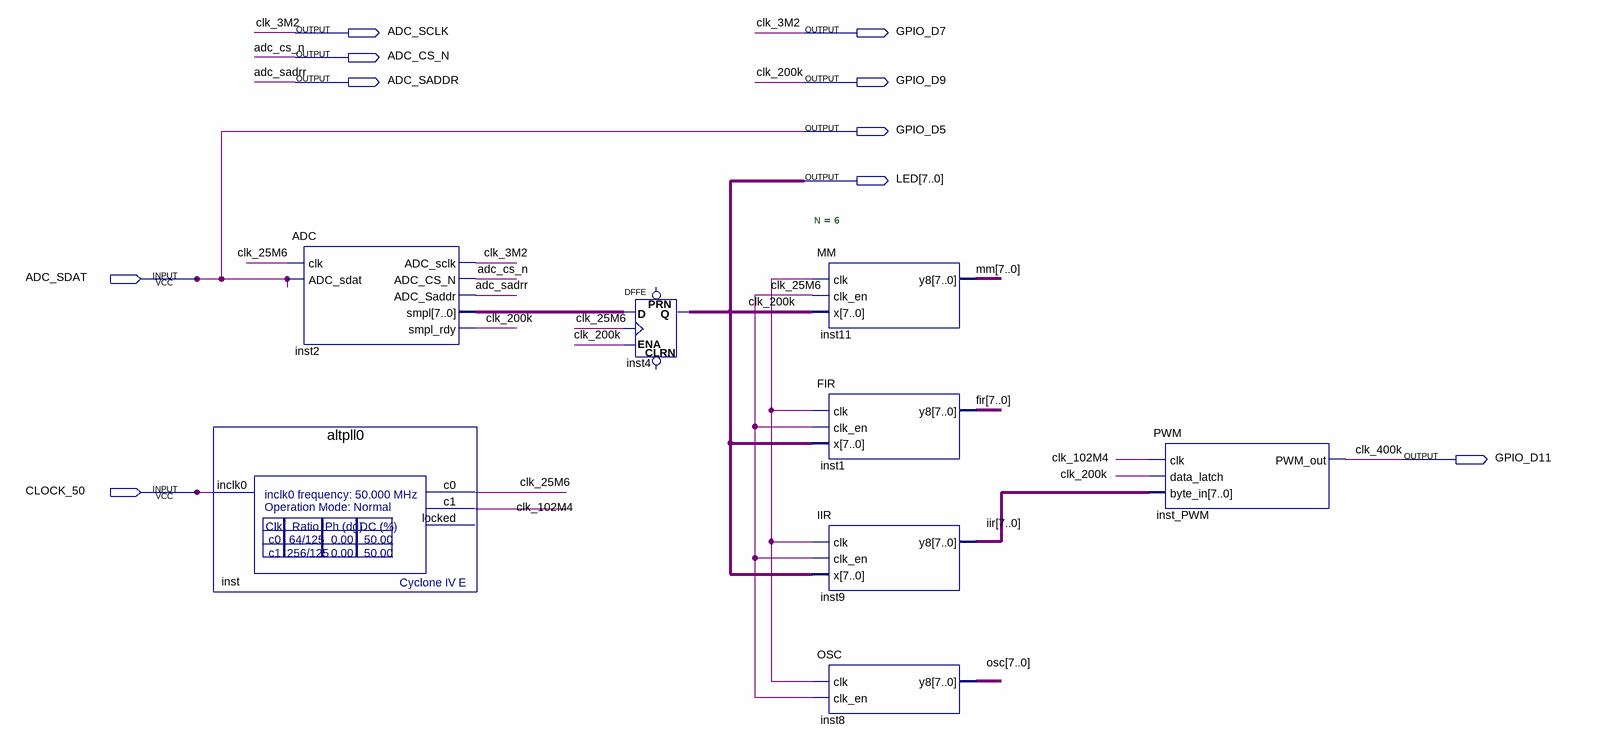
[diagram p0: schematic sheet]
// Quartus schematic main.bdf as structural Verilog: 8 symbols, 10 pins
module main (
  input  ADC_SDAT,
  input  CLOCK_50,
  output ADC_SCLK,
  output GPIO_D7,
  output ADC_CS_N,
  output ADC_SADDR,
  output GPIO_D9,
  output GPIO_D5,
  output [7:0] LED,
  output GPIO_D11
);

  wire clk_25M6, clk_102M4;
  wire [7:0] fir, iir, inst2_smpl, mm, osc;

  altpll0 inst (.inclk0(CLOCK_50), .c0(clk_25M6), .c1(clk_102M4));  // open: locked
  ADC inst2 (
    .clk(clk_25M6), .ADC_sdat(ADC_SDAT), .ADC_sclk(ADC_SCLK), .ADC_CS_N(ADC_CS_N), .ADC_Saddr(ADC_SADDR),
    .smpl(inst2_smpl), .smpl_rdy(GPIO_D9));
  DFFE inst4[7:0] (.D(inst2_smpl), .CLK(clk_25M6), .ENA(GPIO_D9), .Q(LED));  // open: PRN, CLRN
  MM #(.N(6)) inst11 (.clk(clk_25M6), .clk_en(GPIO_D9), .x(LED), .y8(mm));
  FIR inst1 (.clk(clk_25M6), .clk_en(GPIO_D9), .x(LED), .y8(fir));
  IIR inst9 (.clk(clk_25M6), .clk_en(GPIO_D9), .x(LED), .y8(iir));
  OSC inst8 (.clk(clk_25M6), .clk_en(GPIO_D9), .y8(osc));
  PWM inst_PWM (.clk(clk_102M4), .data_latch(GPIO_D9), .byte_in(iir), .PWM_out(GPIO_D11));

  assign GPIO_D5 = ADC_SDAT;
  assign GPIO_D7 = ADC_SCLK;

  // Other names for the same wires on the sheet: adc_sadrr = ADC_SADDR; clk_3M2 = ADC_SCLK; clk_200k = GPIO_D9;
  //   clk_400k = GPIO_D11
endmodule
